# Altium project DDAQ.PrjPcb
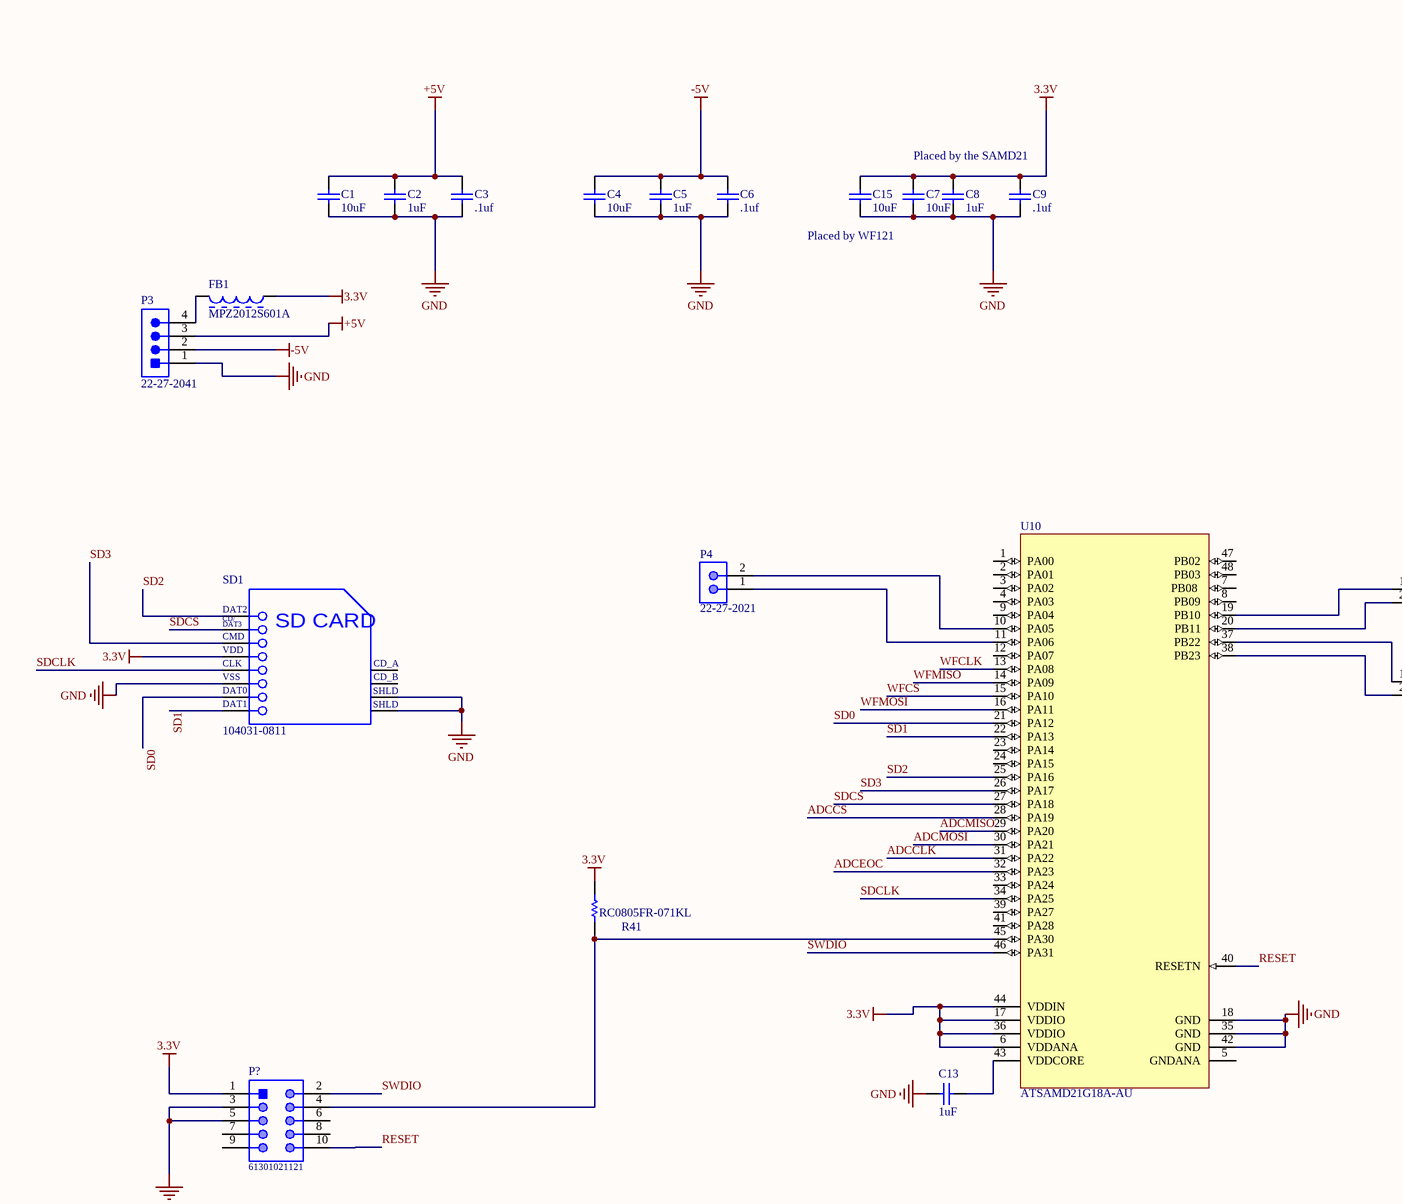
[diagram p0: DDAQ.SchDoc, top left]
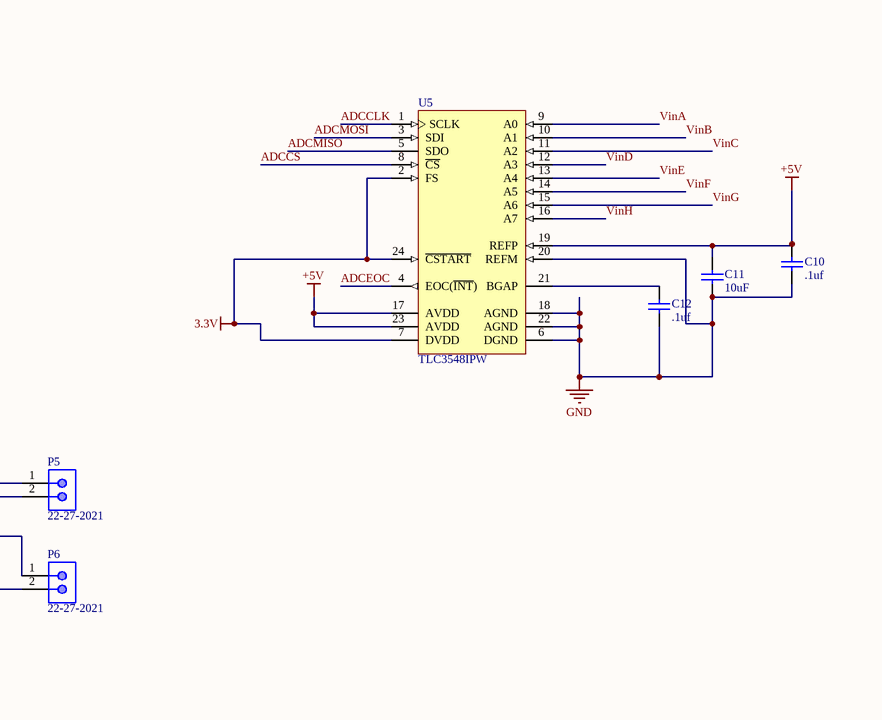
[diagram p1: DDAQ.SchDoc, top middle]
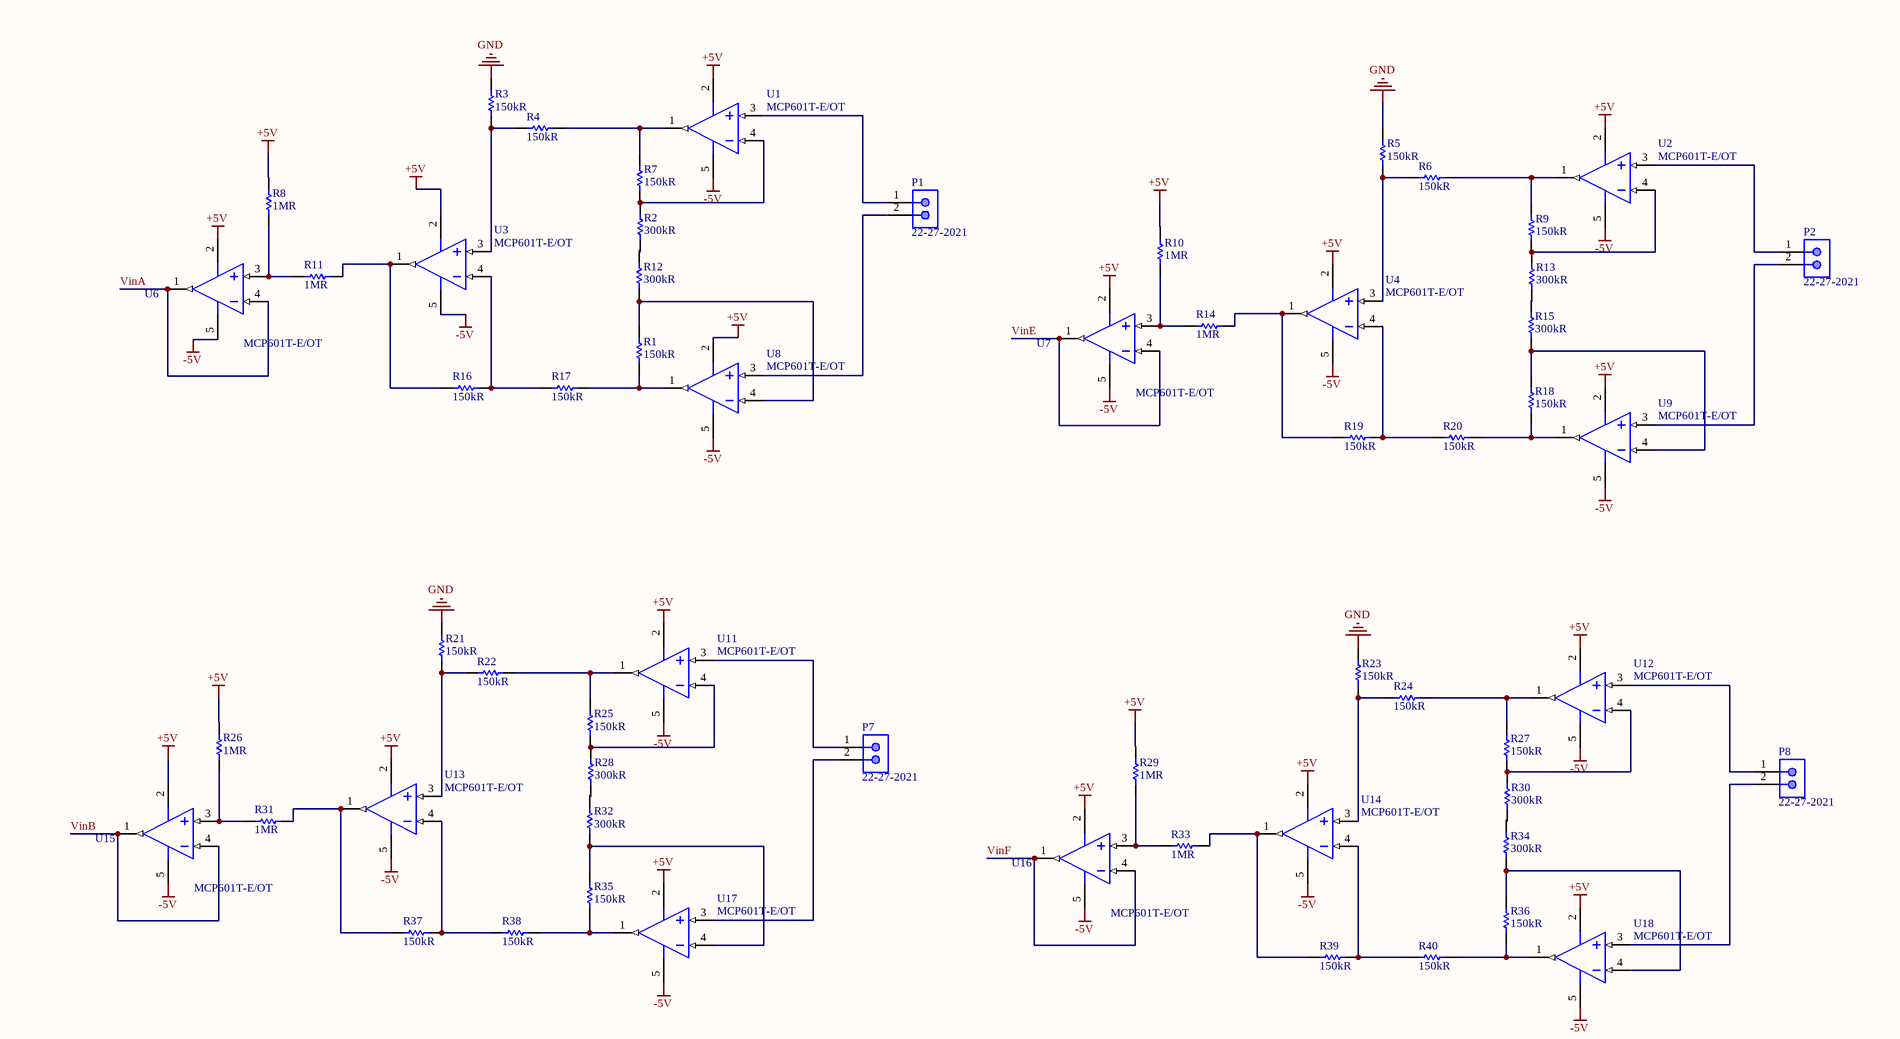
[diagram p2: DDAQ.SchDoc, top right]
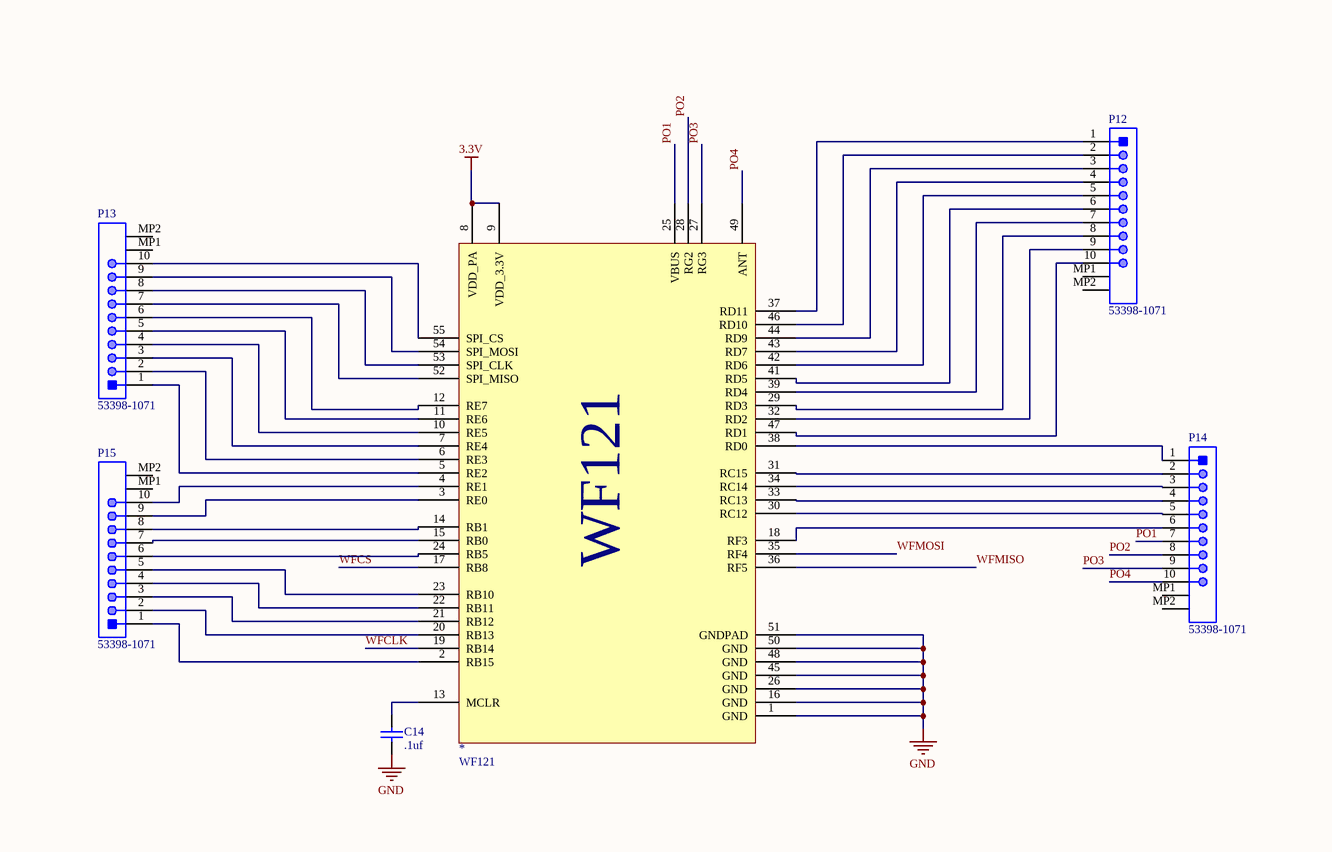
[diagram p3: DDAQ.SchDoc, bottom left]
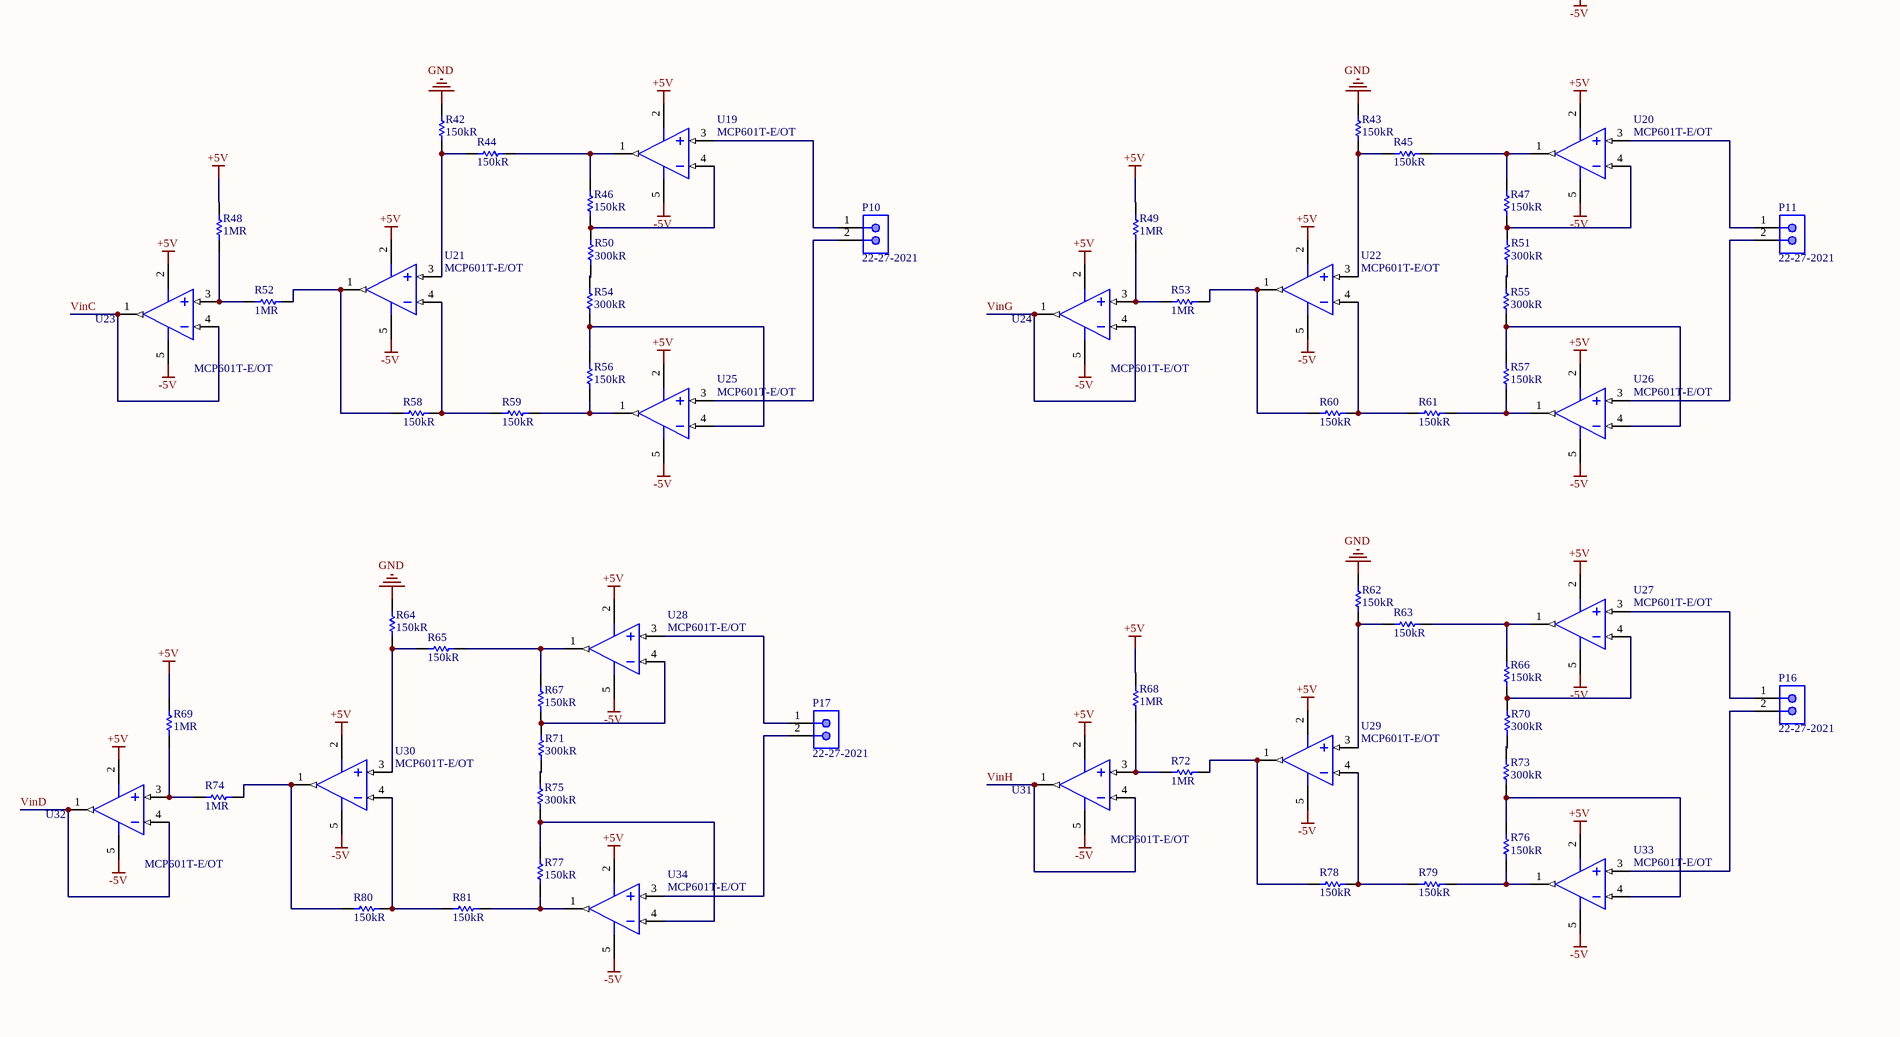
[diagram p4: DDAQ.SchDoc, bottom right]
1 sheet, 150 parts. Net scope: global (net labels, ports and power ports of the same name join across sheets).
Board file: DDAQ.PcbDoc

## Sheet DDAQ.SchDoc
size D

### Parts
*  WF121  [WF121]
C1  10uF  [CAPC1608X90X35NL10T15]
C2  1uF  [CAPC1608X90X35LL15T15]
C3  .1uf  [CAPC2013X94X50NL20T25]
C4  10uF  [CAPC1608X90X35NL10T15]
C5  1uF  [CAPC1608X90X35LL15T15]
C6  .1uf  [CAPC2013X94X50NL20T25]
C7  10uF  [CAPC1608X90X35NL10T15]
C8  1uF  [CAPC1608X90X35LL15T15]
C9  .1uf  [CAPC2013X94X50NL20T25]
C10  .1uf  [CAPC2013X94X50NL20T25]
C11  10uF  [CAPC1608X90X35NL10T15]
C12  .1uf  [CAPC2013X94X50NL20T25]
C13  1uF  [CAPC1608X90X35LL15T15]
C14  .1uf  [CAPC2013X94X50NL20T25]
C15  10uF  [CAPC1608X90X35NL10T15]
FB1  MPZ2012S601A  [TDK-MPZ2012_V]
P1  22-27-2021  [MOLX-22-27-2021_V]
P2  22-27-2021  [MOLX-22-27-2021_V]
P3  22-27-2041  [MOLX-22-27-2041_V]
P4  22-27-2021  [MOLX-22-27-2021_V]
P5  22-27-2021  [MOLX-22-27-2021_V]
P6  22-27-2021  [MOLX-22-27-2021_V]
P7  22-27-2021  [MOLX-22-27-2021_V]
P8  22-27-2021  [MOLX-22-27-2021_V]
P10  22-27-2021  [MOLX-22-27-2021_V]
P11  22-27-2021  [MOLX-22-27-2021_V]
P12  53398-1071  [MOLX-53398-1071_V]
P13  53398-1071  [MOLX-53398-1071_V]
P14  53398-1071  [MOLX-53398-1071_V]
P15  53398-1071  [MOLX-53398-1071_V]
P16  22-27-2021  [MOLX-22-27-2021_V]
P17  22-27-2021  [MOLX-22-27-2021_V]
P?  61301021121  [61301021121]
R1  150kR  [RESC2013X50X30NL20T20]
R2  300kR  [RESC2013X50X40ML20T20]
R3  150kR  [RESC2013X50X30NL20T20]
R4  150kR  [RESC2013X50X30NL20T20]
R5  150kR  [RESC2013X50X30NL20T20]
R6  150kR  [RESC2013X50X30NL20T20]
R7  150kR  [RESC2013X50X30NL20T20]
R8  1MR  [RESC2013X60X35ML10T20]
R9  150kR  [RESC2013X50X30NL20T20]
R10  1MR  [RESC2013X60X35ML10T20]
R11  1MR  [RESC2013X60X35ML10T20]
R12  300kR  [RESC2013X50X40ML20T20]
R13  300kR  [RESC2013X50X40ML20T20]
R14  1MR  [RESC2013X60X35ML10T20]
R15  300kR  [RESC2013X50X40ML20T20]
R16  150kR  [RESC2013X50X30NL20T20]
R17  150kR  [RESC2013X50X30NL20T20]
R18  150kR  [RESC2013X50X30NL20T20]
R19  150kR  [RESC2013X50X30NL20T20]
R20  150kR  [RESC2013X50X30NL20T20]
R21  150kR  [RESC2013X50X30NL20T20]
R22  150kR  [RESC2013X50X30NL20T20]
R23  150kR  [RESC2013X50X30NL20T20]
R24  150kR  [RESC2013X50X30NL20T20]
R25  150kR  [RESC2013X50X30NL20T20]
R26  1MR  [RESC2013X60X35ML10T20]
R27  150kR  [RESC2013X50X30NL20T20]
R28  300kR  [RESC2013X50X40ML20T20]
R29  1MR  [RESC2013X60X35ML10T20]
R30  300kR  [RESC2013X50X40ML20T20]
R31  1MR  [RESC2013X60X35ML10T20]
R32  300kR  [RESC2013X50X40ML20T20]
R33  1MR  [RESC2013X60X35ML10T20]
R34  300kR  [RESC2013X50X40ML20T20]
R35  150kR  [RESC2013X50X30NL20T20]
R36  150kR  [RESC2013X50X30NL20T20]
R37  150kR  [RESC2013X50X30NL20T20]
R38  150kR  [RESC2013X50X30NL20T20]
R39  150kR  [RESC2013X50X30NL20T20]
R40  150kR  [RESC2013X50X30NL20T20]
R41  RC0805FR-071KL  [RESC2013X60X35ML10T20]
R42  150kR  [RESC2013X50X30NL20T20]
R43  150kR  [RESC2013X50X30NL20T20]
R44  150kR  [RESC2013X50X30NL20T20]
R45  150kR  [RESC2013X50X30NL20T20]
R46  150kR  [RESC2013X50X30NL20T20]
R47  150kR  [RESC2013X50X30NL20T20]
R48  1MR  [RESC2013X60X35ML10T20]
R49  1MR  [RESC2013X60X35ML10T20]
R50  300kR  [RESC2013X50X40ML20T20]
R51  300kR  [RESC2013X50X40ML20T20]
R52  1MR  [RESC2013X60X35ML10T20]
R53  1MR  [RESC2013X60X35ML10T20]
R54  300kR  [RESC2013X50X40ML20T20]
R55  300kR  [RESC2013X50X40ML20T20]
R56  150kR  [RESC2013X50X30NL20T20]
R57  150kR  [RESC2013X50X30NL20T20]
R58  150kR  [RESC2013X50X30NL20T20]
R59  150kR  [RESC2013X50X30NL20T20]
R60  150kR  [RESC2013X50X30NL20T20]
R61  150kR  [RESC2013X50X30NL20T20]
R62  150kR  [RESC2013X50X30NL20T20]
R63  150kR  [RESC2013X50X30NL20T20]
R64  150kR  [RESC2013X50X30NL20T20]
R65  150kR  [RESC2013X50X30NL20T20]
R66  150kR  [RESC2013X50X30NL20T20]
R67  150kR  [RESC2013X50X30NL20T20]
R68  1MR  [RESC2013X60X35ML10T20]
R69  1MR  [RESC2013X60X35ML10T20]
R70  300kR  [RESC2013X50X40ML20T20]
R71  300kR  [RESC2013X50X40ML20T20]
R72  1MR  [RESC2013X60X35ML10T20]
R73  300kR  [RESC2013X50X40ML20T20]
R74  1MR  [RESC2013X60X35ML10T20]
R75  300kR  [RESC2013X50X40ML20T20]
R76  150kR  [RESC2013X50X30NL20T20]
R77  150kR  [RESC2013X50X30NL20T20]
R78  150kR  [RESC2013X50X30NL20T20]
R79  150kR  [RESC2013X50X30NL20T20]
R80  150kR  [RESC2013X50X30NL20T20]
R81  150kR  [RESC2013X50X30NL20T20]
SD1  104031-0811  [MOLX-104031-0811_V]
U1  MCP601T-E/OT  [SOT-23-OT5_N]
U2  MCP601T-E/OT  [SOT-23-OT5_N]
U3  MCP601T-E/OT  [SOT-23-OT5_N]
U4  MCP601T-E/OT  [SOT-23-OT5_N]
U5  TLC3548IPW  [TI-PW24_M]
U6  MCP601T-E/OT  [SOT-23-OT5_N]
U7  MCP601T-E/OT  [SOT-23-OT5_N]
U8  MCP601T-E/OT  [SOT-23-OT5_N]
U9  MCP601T-E/OT  [SOT-23-OT5_N]
U10  ATSAMD21G18A-AU  [ATML-TQFP48_M]
U11  MCP601T-E/OT  [SOT-23-OT5_N]
U12  MCP601T-E/OT  [SOT-23-OT5_N]
U13  MCP601T-E/OT  [SOT-23-OT5_N]
U14  MCP601T-E/OT  [SOT-23-OT5_N]
U15  MCP601T-E/OT  [SOT-23-OT5_N]
U16  MCP601T-E/OT  [SOT-23-OT5_N]
U17  MCP601T-E/OT  [SOT-23-OT5_N]
U18  MCP601T-E/OT  [SOT-23-OT5_N]
U19  MCP601T-E/OT  [SOT-23-OT5_N]
U20  MCP601T-E/OT  [SOT-23-OT5_N]
U21  MCP601T-E/OT  [SOT-23-OT5_N]
U22  MCP601T-E/OT  [SOT-23-OT5_N]
U23  MCP601T-E/OT  [SOT-23-OT5_N]
U24  MCP601T-E/OT  [SOT-23-OT5_N]
U25  MCP601T-E/OT  [SOT-23-OT5_N]
U26  MCP601T-E/OT  [SOT-23-OT5_N]
U27  MCP601T-E/OT  [SOT-23-OT5_N]
U28  MCP601T-E/OT  [SOT-23-OT5_N]
U29  MCP601T-E/OT  [SOT-23-OT5_N]
U30  MCP601T-E/OT  [SOT-23-OT5_N]
U31  MCP601T-E/OT  [SOT-23-OT5_N]
U32  MCP601T-E/OT  [SOT-23-OT5_N]
U33  MCP601T-E/OT  [SOT-23-OT5_N]
U34  MCP601T-E/OT  [SOT-23-OT5_N]

### Nets
3.3V: *.8(VDD_PA) *.9(VDD_3.3V) C7.2 C8.2 C9.2 C15.2 FB1.1 P?.1 R41.2 SD1.4(VDD) U5.2(FS) U5.7(DVDD) U5.24(~{CSTART}) U10.6(VDDANA) U10.17(VDDIO) U10.36(VDDIO) U10.44(VDDIN)
+5V: C1.2 C2.2 C3.2 C10.2 C11.2 P3.3 R8.2 R10.2 R26.2 R29.2 R48.2 R49.2 R68.2 R69.2 U1.2(VSS) U2.2(VSS) U3.2(VSS) U4.2(VSS) U5.17(AVDD) U5.19(REFP) U5.23(AVDD) U6.2(VSS) U7.2(VSS) U8.2(VSS) U9.2(VSS) U11.2(VSS) U12.2(VSS) U13.2(VSS) U14.2(VSS) U15.2(VSS) U16.2(VSS) U17.2(VSS) U18.2(VSS) U19.2(VSS) U20.2(VSS) U21.2(VSS) U22.2(VSS) U23.2(VSS) U24.2(VSS) U25.2(VSS) U26.2(VSS) U27.2(VSS) U28.2(VSS) U29.2(VSS) U30.2(VSS) U31.2(VSS) U32.2(VSS) U33.2(VSS) U34.2(VSS)
-5V: C4.2 C5.2 C6.2 P3.2 U1.5(VDD) U2.5(VDD) U3.5(VDD) U4.5(VDD) U6.5(VDD) U7.5(VDD) U8.5(VDD) U9.5(VDD) U11.5(VDD) U12.5(VDD) U13.5(VDD) U14.5(VDD) U15.5(VDD) U16.5(VDD) U17.5(VDD) U18.5(VDD) U19.5(VDD) U20.5(VDD) U21.5(VDD) U22.5(VDD) U23.5(VDD) U24.5(VDD) U25.5(VDD) U26.5(VDD) U27.5(VDD) U28.5(VDD) U29.5(VDD) U30.5(VDD) U31.5(VDD) U32.5(VDD) U33.5(VDD) U34.5(VDD)
GND: *.1(GND) *.16(GND) *.26(GND) *.45(GND) *.48(GND) *.50(GND) *.51(GNDPAD) C1.1 C2.1 C3.1 C4.1 C5.1 C6.1 C7.1 C8.1 C9.1 C10.1 C11.1 C12.1 C13.2 C14.1 C15.1 P3.1 P?.3 P?.5 R3.1 R5.1 R21.1 R23.1 R42.1 R43.1 R62.1 R64.1 SD1.6(VSS2) SD1.11(SHLD1) SD1.12(SHLD2) U5.6(DGND) U5.18(AGND) U5.20(REFM) U5.22(AGND) U10.18(GND) U10.35(GND) U10.42(GND)
ADCCLK: U5.1(SCLK) U10.31(PA22)
ADCCS: U5.8(~{CS}) U10.28(PA19)
ADCEOC: U5.4(EOC(~{INT})) U10.32(PA23)
ADCMISO: U5.5(SDO) U10.29(PA20)
ADCMOSI: U5.3(SDI) U10.30(PA21)
PO1: *.25(VBUS) P14.7
PO2: *.28(RG2) P14.8
PO3: *.27(RG3) P14.9
PO4: *.49(ANT) P14.10
RESET: P?.10 U10.40(RESETN)
SD0: SD1.7(DAT0) U10.21(PA12)
SD1: SD1.8(DAT1) U10.22(PA13)
SD2: SD1.1(CD/DAT3) U10.25(PA16)
SD3: SD1.3(VSS1) U10.26(PA17)
SDCLK: SD1.5(CLK) U10.34(PA25)
SDCS: SD1.2(CMD) U10.27(PA18)
SWDIO: P?.2 U10.46(PA31)
VinA: U5.9(A0) U6.1(VOUT) U6.4(VIN-)
VinB: U5.10(A1) U15.1(VOUT) U15.4(VIN-)
VinC: U5.11(A2) U23.1(VOUT) U23.4(VIN-)
VinD: U5.12(A3) U32.1(VOUT) U32.4(VIN-)
VinE: U5.13(A4) U7.1(VOUT) U7.4(VIN-)
VinF: U5.14(A5) U16.1(VOUT) U16.4(VIN-)
VinG: U5.15(A6) U24.1(VOUT) U24.4(VIN-)
VinH: U5.16(A7) U31.1(VOUT) U31.4(VIN-)
WFCLK: *.19(RB14) U10.13(PA08)
WFCS: *.17(RB8) U10.15(PA10)
WFMISO: *.36(RF5) U10.14(PA09)
WFMOSI: *.35(RF4) U10.16(PA11)
Net*_2: *.2(RB15) P15.1
Net*_3: *.3(RE0) P15.9
Net*_4: *.4(RE1) P15.10
Net*_5: *.5(RE2) P13.1
Net*_6: *.6(RE3) P13.2
Net*_7: *.7(RE4) P13.3
Net*_10: *.10(RE5) P13.4
Net*_11: *.11(RE6) P13.5
Net*_12: *.12(RE7) P13.6
Net*_13: *.13(MCLR) C14.2
Net*_14: *.14(RB1) P15.8
Net*_15: *.15(RB0) P15.7
Net*_18: *.18(RF3) P14.6
Net*_20: *.20(RB13) P15.2
Net*_21: *.21(RB12) P15.3
Net*_22: *.22(RB11) P15.4
Net*_23: *.23(RB10) P15.5
Net*_24: *.24(RB5) P15.6
Net*_29: *.29(RD3) P12.8
Net*_30: *.30(RC12) P14.5
Net*_31: *.31(RC15) P14.2
Net*_32: *.32(RD2) P12.9
Net*_33: *.33(RC13) P14.4
Net*_34: *.34(RC14) P14.3
Net*_37: *.37(RD11) P12.1
Net*_38: *.38(RD0) P14.1
Net*_39: *.39(RD4) P12.7
Net*_41: *.41(RD5) P12.6
Net*_42: *.42(RD6) P12.5
Net*_43: *.43(RD7) P12.4
Net*_44: *.44(RD9) P12.3
Net*_46: *.46(RD10) P12.2
Net*_47: *.47(RD1) P12.10
Net*_52: *.52(SPI_MISO) P13.7
Net*_53: *.53(SPI_CLK) P13.8
Net*_54: *.54(SPI_MOSI) P13.9
Net*_55: *.55(SPI_CS) P13.10
NetC12_2: C12.2 U5.21(BGAP)
NetC13_1: C13.1 U10.43(VDDCORE)
NetFB1_2: FB1.2 P3.4
NetP1_1: P1.1 U1.3(VIN+)
NetP1_2: P1.2 U8.3(VIN+)
NetP2_1: P2.1 U2.3(VIN+)
NetP2_2: P2.2 U9.3(VIN+)
NetP4_1: P4.1 U10.11(PA06)
NetP4_2: P4.2 U10.10(PA05)
NetP5_1: P5.1 U10.19(PB10)
NetP5_2: P5.2 U10.20(PB11)
NetP6_1: P6.1 U10.37(PB22)
NetP6_2: P6.2 U10.38(PB23)
NetP7_1: P7.1 U11.3(VIN+)
NetP7_2: P7.2 U17.3(VIN+)
NetP8_1: P8.1 U12.3(VIN+)
NetP8_2: P8.2 U18.3(VIN+)
NetP10_1: P10.1 U19.3(VIN+)
NetP10_2: P10.2 U25.3(VIN+)
NetP11_1: P11.1 U20.3(VIN+)
NetP11_2: P11.2 U26.3(VIN+)
NetP16_1: P16.1 U27.3(VIN+)
NetP16_2: P16.2 U33.3(VIN+)
NetP17_1: P17.1 U28.3(VIN+)
NetP17_2: P17.2 U34.3(VIN+)
NetP?_4: P?.4 R41.1 U10.45(PA30)
NetR1_1: R1.1 R17.1 U8.1(VOUT)
NetR1_2: R1.2 R12.1 U8.4(VIN-)
NetR2_1: R2.1 R12.2
NetR2_2: R2.2 R7.1 U1.4(VIN-)
NetR3_2: R3.2 R4.2 U3.3(VIN+)
NetR4_1: R4.1 R7.2 U1.1(VOUT)
NetR5_2: R5.2 R6.2 U4.3(VIN+)
NetR6_1: R6.1 R9.2 U2.1(VOUT)
NetR8_1: R8.1 R11.2 U6.3(VIN+)
NetR9_1: R9.1 R13.2 U2.4(VIN-)
NetR10_1: R10.1 R14.2 U7.3(VIN+)
NetR11_1: R11.1 R16.2 U3.1(VOUT)
NetR13_1: R13.1 R15.2
NetR14_1: R14.1 R19.2 U4.1(VOUT)
NetR15_1: R15.1 R18.2 U9.4(VIN-)
NetR16_1: R16.1 R17.2 U3.4(VIN-)
NetR18_1: R18.1 R20.1 U9.1(VOUT)
NetR19_1: R19.1 R20.2 U4.4(VIN-)
NetR21_2: R21.2 R22.2 U13.3(VIN+)
NetR22_1: R22.1 R25.2 U11.1(VOUT)
NetR23_2: R23.2 R24.2 U14.3(VIN+)
NetR24_1: R24.1 R27.2 U12.1(VOUT)
NetR25_1: R25.1 R28.2 U11.4(VIN-)
NetR26_1: R26.1 R31.2 U15.3(VIN+)
NetR27_1: R27.1 R30.2 U12.4(VIN-)
NetR28_1: R28.1 R32.2
NetR29_1: R29.1 R33.2 U16.3(VIN+)
NetR30_1: R30.1 R34.2
NetR31_1: R31.1 R37.2 U13.1(VOUT)
NetR32_1: R32.1 R35.2 U17.4(VIN-)
NetR33_1: R33.1 R39.2 U14.1(VOUT)
NetR34_1: R34.1 R36.2 U18.4(VIN-)
NetR35_1: R35.1 R38.1 U17.1(VOUT)
NetR36_1: R36.1 R40.1 U18.1(VOUT)
NetR37_1: R37.1 R38.2 U13.4(VIN-)
NetR39_1: R39.1 R40.2 U14.4(VIN-)
NetR42_2: R42.2 R44.2 U21.3(VIN+)
NetR43_2: R43.2 R45.2 U22.3(VIN+)
NetR44_1: R44.1 R46.2 U19.1(VOUT)
NetR45_1: R45.1 R47.2 U20.1(VOUT)
NetR46_1: R46.1 R50.2 U19.4(VIN-)
NetR47_1: R47.1 R51.2 U20.4(VIN-)
NetR48_1: R48.1 R52.2 U23.3(VIN+)
NetR49_1: R49.1 R53.2 U24.3(VIN+)
NetR50_1: R50.1 R54.2
NetR51_1: R51.1 R55.2
NetR52_1: R52.1 R58.2 U21.1(VOUT)
NetR53_1: R53.1 R60.2 U22.1(VOUT)
NetR54_1: R54.1 R56.2 U25.4(VIN-)
NetR55_1: R55.1 R57.2 U26.4(VIN-)
NetR56_1: R56.1 R59.1 U25.1(VOUT)
NetR57_1: R57.1 R61.1 U26.1(VOUT)
NetR58_1: R58.1 R59.2 U21.4(VIN-)
NetR60_1: R60.1 R61.2 U22.4(VIN-)
NetR62_2: R62.2 R63.2 U29.3(VIN+)
NetR63_1: R63.1 R66.2 U27.1(VOUT)
NetR64_2: R64.2 R65.2 U30.3(VIN+)
NetR65_1: R65.1 R67.2 U28.1(VOUT)
NetR66_1: R66.1 R70.2 U27.4(VIN-)
NetR67_1: R67.1 R71.2 U28.4(VIN-)
NetR68_1: R68.1 R72.2 U31.3(VIN+)
NetR69_1: R69.1 R74.2 U32.3(VIN+)
NetR70_1: R70.1 R73.2
NetR71_1: R71.1 R75.2
NetR72_1: R72.1 R78.2 U29.1(VOUT)
NetR73_1: R73.1 R76.2 U33.4(VIN-)
NetR74_1: R74.1 R80.2 U30.1(VOUT)
NetR75_1: R75.1 R77.2 U34.4(VIN-)
NetR76_1: R76.1 R79.1 U33.1(VOUT)
NetR77_1: R77.1 R81.1 U34.1(VOUT)
NetR78_1: R78.1 R79.2 U29.4(VIN-)
NetR80_1: R80.1 R81.2 U30.4(VIN-)

Not connected (* = marked no-connect by the designer): P12 MP1 MP2; P13 MP1 MP2; P14 MP1 MP2; P15 MP1 MP2; P? 6 7 8 9; SD1 9(CD_A) 10(CD_B); U10 1(PA00) 2(PA01) 3(PA02) 4(PA03) 5(GNDANA) 7(PB08_) 8(PB09) 9(PA04) 12(PA07) 23(PA14_) 24(PA15) 33(PA24) 39(PA27) 41(PA28_) 47(PB02) 48(PB03)

### Notes on the sheet
- Placed by the SAMD21
- Placed by WF121
- (in symbol CMP-2000-05825-1) DAT2; CD/; DAT3; SD CARD; VSS; SHLD

### Library data of the parts
* = WF121: WF121 WIFI Module.; ComponentLink1Description: Datasheet; ComponentLink1URL: https://www.silabs.com/documents/public/data-sheets/WF121-DataSheet.pdf
C1 C4 C7 C11 C15 = CMP-2006-02792-1: Part Number: GRM188R60J106ME47D; Manufacturer: Murata
C2 C5 C8 C13 = CMP-2006-04551-1: Part Number: 0603ZC105KAT2A; Manufacturer: AVX Interconnect / Elco
C3 C6 C9 C10 C12 C14 = CMP-2007-04454-1: Part Number: 0805YC104KAT2A; Manufacturer: AVX Interconnect / Elco
FB1 = CMP-2000-05400-1: Chip Bead for Power Line, 600 Ohm, +/- 25%, 2 A, -55 to 125 degC, 2-Pin SMD (0805), RoHS, Tape and Reel; Manufacturer: TDK; Maximum DC Current: 2A; Impedance: 600Ohms; Test Frequency: 100MHz; Case Length: 2mm; Maximum DC Resistance: 100mOhms; Case Height: 0.85mm; Case Width: 1.25mm; Factory Pack Quantity: 4000; Operating Temperature Range: -55Cto+125C; Packaging: Reel; Datasheet URL: https://datasheet.ciiva.com/23763/1750041-23763249.pdf; Manufacturer URL: http://www.tdk.com/; Product Category: EMIFilterBeads,Chips&Arrays; Tolerance: 25%; Product: FerriteChipBeads; Package / Case: 0805(2012metric); RoHS: Details; Dimensions: 1.25mmWx2mmLx0.85mmH; Datasheet Version: Jul-13; Termination Style: SMD/SMT; Package Reference: 805; Brand: TDK; Package Description: 2-Pin Surface Mount Device, Body 2 x 1.25 mm
P1 P2 P4-P8 P10 P11 P16 P17 = CMP-2000-05537-1: Male Header, Pitch 2.54 mm, 1 x 2 Position, Height 11.7 mm, Tail Length 3.56 mm, 0 to 75 degC, RoHS, Bulk; Manufacturer: Molex; PartNumber: 0022272021; Current rating: 4A; Package Version: Rev. BC, 02/2012; Voltage rating: 250V; No. of Positions: 2; Pitch: 2.54mm; No. of Rows: 1; Orientation: Vertical; Operating temperature: 0°Cto+75°C; Manufacturer URL: http://www.molex.com/; Mounting Technology: ThroughHole; Housing material: Nylon(UL94V-0); Package Description: 2-Leads Header, Body 5.08 x 5.8 mm, Pitch 2.54 mm; Voltage - Max: 250V; Datasheet URL: http://www.molex.com/pdm_docs/sd/022272021_sd.pdf; Package Reference: 22-27-2021; Contact material: Tinplatedbrass; Current - Max: 4A; Datasheet Version: Rev. F, 06/2009
P3 = CMP-2000-05243-1: Male Header, Pitch 2.54 mm, 1 x 4 Position, Height 11.7 mm, Tail Length 3.56 mm, RoHS, Bulk; Manufacturer: Molex; Voltage rating: 250V; Current rating: 4A; Datasheet Version: Rev. F, 06/2009; Operating temperature: 0degCto+75degC; Contact material: Tinplatedbrass; Manufacturer URL: http://www.molex.com/; Housing material: Nylon(UL94V-0); Datasheet URL: http://www.molex.com/pdm_docs/sd/022272041_sd.pdf
P12-P15 = CMP-2000-05635-1: Male Header, Pitch 1.25 mm, 1 x 10 Position, Height 4.7 mm, -40 to 85 degC, RoHS, Tape and Reel; Manufacturer: Molex; Mounting Angle: Vertical; Pitch: 1.25mm; Voltage Rating: 125V; Current Rating: 1A; Number of Rows: 1Row; Housing Material: Nylon; Mounting Technology: SurfaceMount; Mounting Style: SMD; Contact Material: PhosphorBronze; Product: Headers; Datasheet URL: http://www.molex.com/pdm_docs/sd/533981071_sd.pdf; Manufacturer URL: http://www.molex.com/; Datasheet Version: Rev. J, 09/2015; Factory Pack Quantity: 1000; Brand: Molex; Packaging: Reel; Product Category: Headers&WireHousings; Contact Gender: Pin(Male); Number of Positions: 10Position; RoHS: Details; Contact Plating: Tin; Package Description: Male Header, Pitch 1.25 mm, 1 x 10 Position, Height 4.7 mm; Series: 53398; Type: Shrouded; Package Reference: 53398-1071; Tradename: PicoBlade; Termination Style: SMD
P? = CMP-1502-01084-1: THT Vertical Pin Header WR-PHD, Pitch 2.54 mm, Dual Row, 10 pins; Manufacturer: Wurth Elektronik; Working Voltage: 250VAC; Pitch: 2.54mm; Contact Resistance: 20mOhm; Gender: Male; Rated Current: 3A; Withstanding Voltage: 500VAC; Pin Number: 10; Operating Temperature: -40to105degC; Mounting Technology: THT; Publisher: WurthElektronik; Manufacturer URL: http://www.we-online.de; Part Number: 61301021121; Row Number: Dual; Packaging: Bag; Orientation: Vertical; Package Reference: 61301021121; Datasheet URL: https://katalog.we-online.de/em/datasheet/6130xx21121.pdf
R1 R3-R7 R9 R16-R25 R27 R35-R40 R42-R47 R56-R67 R76-R81 = CMP-2001-04961-1: Part Number: CRCW0805150KFKTA; Manufacturer: Vishay Dale
R2 R12 R13 R15 R28 R30 R32 R34 R50 R51 R54 R55 R70 R71 R73 R75 = CMP-2001-04851-1: Part Number: RG2012N-304-W-T1; Manufacturer: Susumu
R8 R10 R11 R14 R26 R29 R31 R33 R48 R49 R52 R53 R68 R69 R72 R74 = CMP-2001-01491-1: Manufacturer: Yageo; Part Number: RT0805BRE071ML
R41 = CMP-2100-03671-1: Chip Resistor, 1 KOhm, +/- 1%, 125 mW, -55 to 155 degC, 0805 (2012 Metric), RoHS, Tape and Reel; Manufacturer: Yageo; Temperature Coefficient: 100ppm/degreesC; Voltage Rating (DC): 150V; Max Power Dissipation: 125mW; Resistance: 1KOhm; Number of Pins: 2; Number of Terminations: 2; Datasheet URL: http://www.yageo.com/NewPortal/yageodocoutput?fileName=/pdf/R-Chip/PYu-RC_Group_51_RoHS_L_5.pdf; Length: 0.079inch; Package Description: 2-Pin Surface Mounted Device, Body 2 x 1.25 mm; Depth: 1.25mm; Height: 0.024inch; Military Standard: Not; Case/Package: 0805; Package Reference: 0805; RoHSCompliant: true; Lead Free: LeadFree; Packaging: TapeandReel; Package Quantity: 1; Datasheet Version: Rev. 5, 10/2016; Tolerance: 1%; Min Operating Temperature: -55degC; Voltage Rating: 150V; Composition: ThickFilm; Case Code (Imperial): 0805; Power Rating: 125mW; Width: 0.049inch; Case Code (Metric): 2012; Manufacturer URL: http://www.yageo.com/; Max Operating Temperature: 155degC; REACH SVHC: Unknown; Termination: SMD/SMT
SD1 = CMP-2000-05825-1: Micro SD Card, RA, -25 to 85 degC, 8-Pin SMD, RoHS, Tape and Reel; Voltage Rating: 10VAC/DC; Number of Contacts: 8; Insertion - Extraction Style: Push-Pull; Pitch: 1.1mm; Mating Cycles: 10000; Brand: Molex; Current Rating: 500mA; Manufacturer URL: http://www.molex.com/; Card Type: microSD; Mounting Type: Standard; Height: 1.42mm; Mounting Technology: SurfaceMount; Contact Plating: Gold; Product Category: MemoryCardConnectors; Package Description: 8-Pin Surface Mount Device, Body 11.95 x 11.4 mm, Pitch 1.1 mm; Datasheet URL: http://www.molex.com/pdm_docs/sd/1040310811_sd.pdf; Termination Style: SMD; Length: 11.4mm; Housing Material: LiquidCrystalPolymer(LCP); Orientation: RightAngle; RoHS: True; Contact Material: PhosphorBronze; Datasheet Version: Rev. E, 04/2006; Packaging: Reel; Manufacturer: Molex; Series: 104031; Product: CardConnectors; Number of Rows: 1Row; Package Reference: 104031-0811
U1-U4 U6-U9 U11-U34 = CMP-0187-00431-2: 2.7V to 6.0V Single Supply CMOS Operational Amplifier, 5-Pin SOT-23, Extended Temperature, Tape and Reel; Code_IPC: SOT23-5; PackageReference: SOT-23-OT5; ComponentLink2URL: http://ww1.microchip.com/downloads/en/DeviceDoc/21314g.pdf; ComponentLink2Description: Datasheet; ComponentLink1URL: http://www.microchip.com/; ComponentLink3URL: http://www.microchip.com/stellent/groups/techpub_sg/documents/packagingspec/en012702.pdf; ComponentLink1Description: Manufacturer URL; PackageVersion: revBB, Aug-2009; PackageDescription: 5-Lead Plastic Small Outline Transistor (OT) [SOT-23]; ComponentLink3Description: Package Specification; RevisionNote: URLs added.; DatasheetVersion: revG, Dec-2007
U5 = CMP-0003-02018-1: 14-Bit, 5 V, 200 kSPS, 8-Channel Unipolar ADC, -40 to 85 degC, 24-pin SOP (PW24), Green (RoHS & no Sb/Br); Manufacturer: Texas Instruments; INL(Max)(+/-LSB): 1; Analog Voltage AV/DD(Max)(V): 5.5; SFDR(dB): 97; Interface: Serial SPI; SNR(dB): 81; ENOB(Bits): 13.1; SubFamily: Precision ADC (<=10MSPS); Analog Voltage AV/DD(Min)(V): 4.5; Architecture: SAR; Sample Rate (max)(SPS): 200k; SINAD(dB): 80.8; # Input Channels: 8; Resolution(Bits): 14; Digital Supply(Min)(V): 2.7; Mounting Technology: Surface Mount; Eco-Plan: Green (RoHS & no Sb/Br); PackageReference: PW24; ComponentLink1Description: Manufacturer URL; Digital Supply(Max)(V): 5.5; PartNumber: TLC3548IPW; PackageDescription: 24-Pin Plastic Small Outline, Body 7.8 x 4.4 mm, Pitch 0.65 mm; ComponentLink3Description: Package Specification; ComponentLink2Description: Datasheet; DatasheetVersion: SLAS266C; ComponentLink2URL: http://www.ti.com/general/docs/lit/getliterature.tsp?genericPartNumber=TLC3548&fileType=pdf; Code_JEDEC: MO-153; ComponentLink3URL: http://www.ti.com/litv/pdf/mpds363; ComponentLink1URL: http://www.ti.com/; PackageVersion: 4040064-6/G, 02/2011
U10 = CMP-2100-03585-1: SMART ARM-Based Microcontroller, 1.62 to 3.63 V, 256 KB Flash, 32 KB SRAM, -40 to 85 degC, 48-Pin TQFP, RoHS, Tray; Manufacturer: Atmel; Max Frequency: 48MHz; Number of Timers/Counters: 6; Max Supply Voltage: 3.63V; Min Supply Voltage: 1.62V; Packaging: Tray; Datasheet Version: Rev. N, 10/2016; Datasheet URL: http://www.atmel.com/images/atmel-42181-sam-d21_datasheet.pdf; REACH SVHC: NoSVHC; RoHSCompliant: true; Max Operating Temperature: 85degC; Manufacturer URL: http://www.atmel.com/; Contact Plating: Tin; Frequency: 48MHz; Package Description: 48-Pin Thin Profile Plastic Quad Flat Package, Body 7 x 7 mm, Pitch 0.5 mm; Package Reference: TQFP48; Lead Free: LeadFree; Number of Pins: 48; Min Operating Temperature: -40degC; Case/Package: TQFP; Mount: SurfaceMount